# EAGLE design v4.0 (EAGLE 8.6.3)
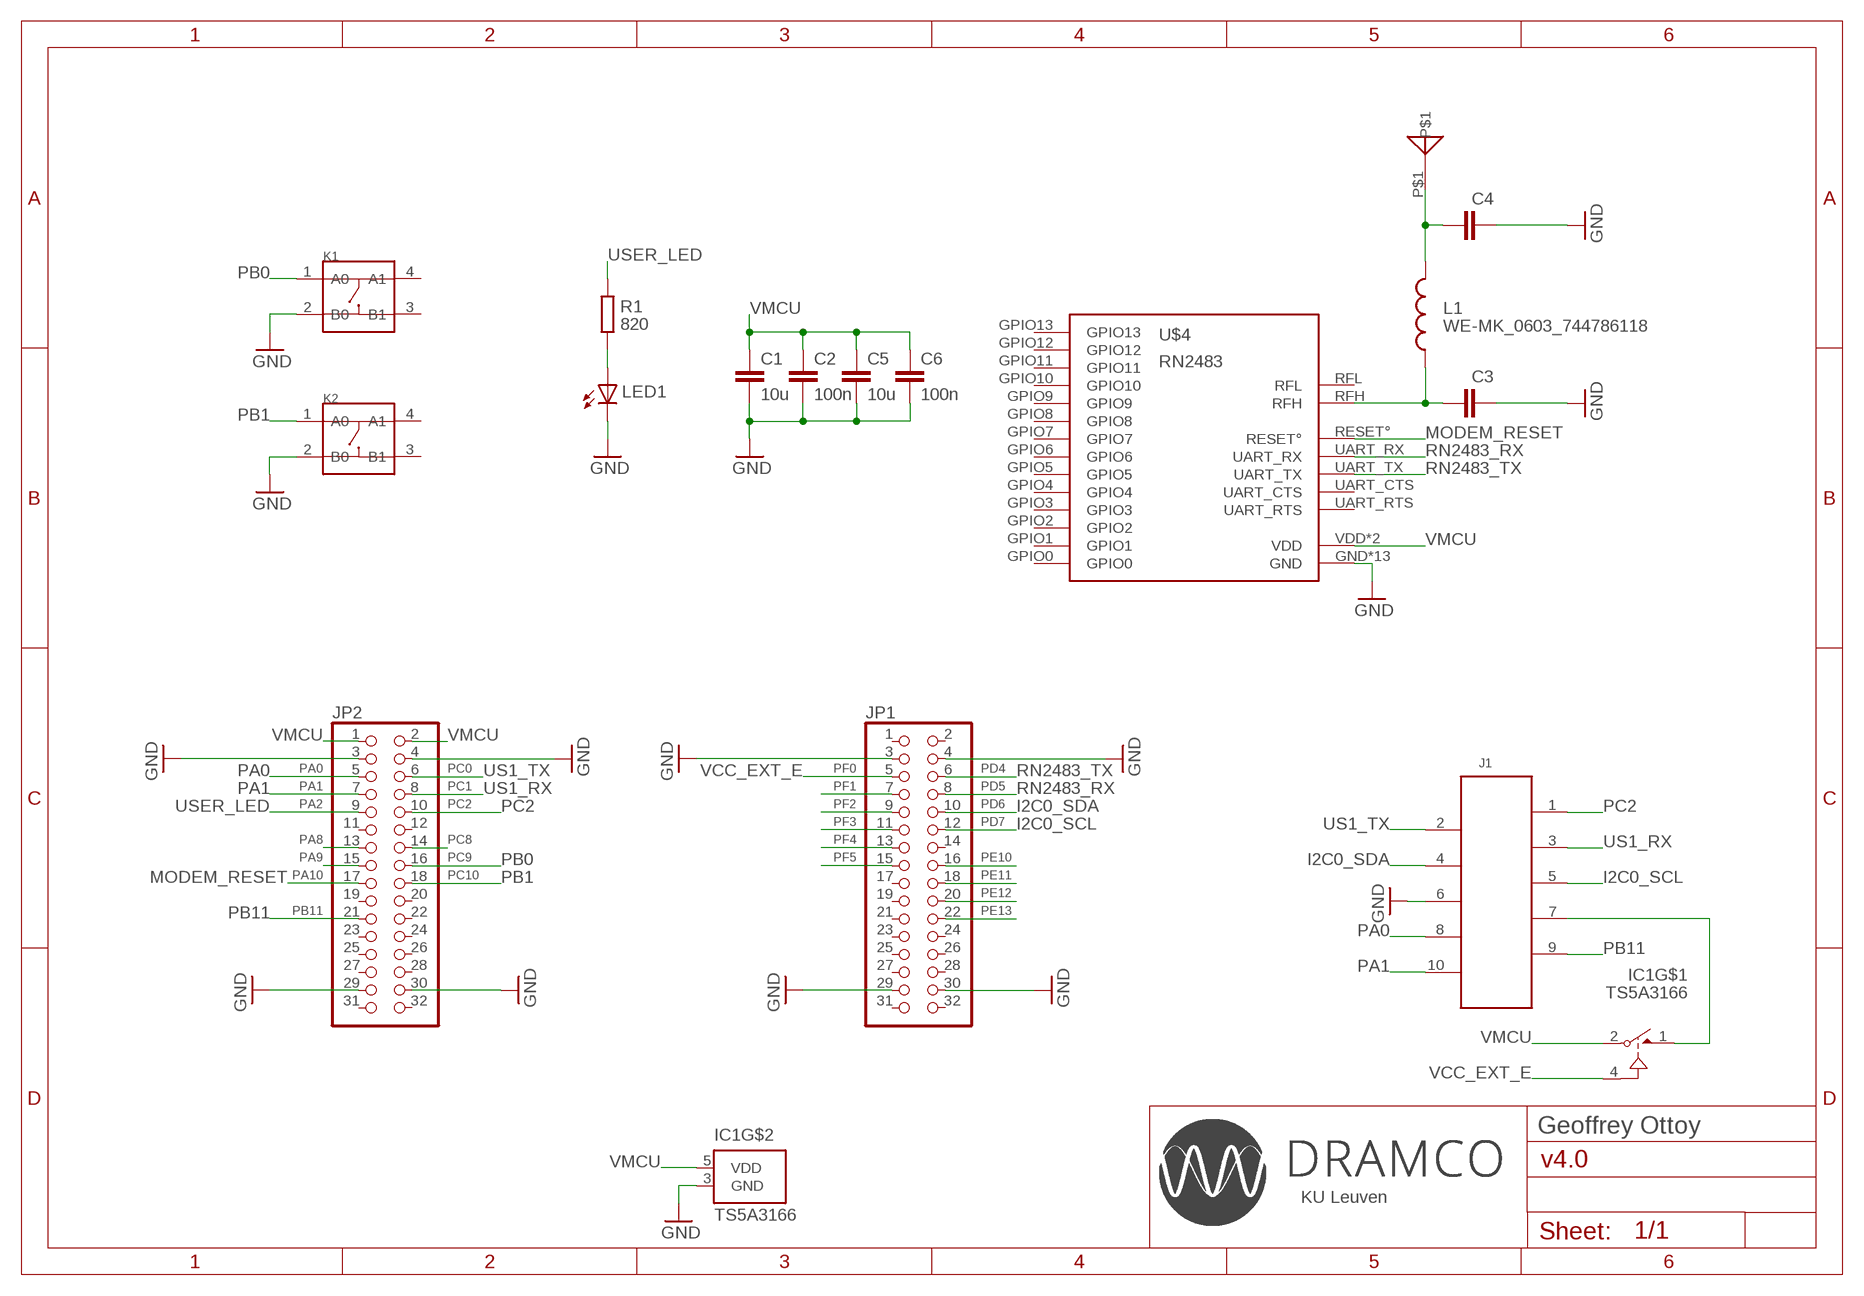
[diagram p0: schematic, sheet 1]

## Parts
C1  10u  C-EUC0805K  [C0805K]
C2  100n  C-EUC0805K  [C0805K]
C3  C-EUC0603K  [C0603K]
C4  C-EUC0603K  [C0603K]
C5  10u  C-EUC0805K  [C0805K]
C6  100n  C-EUC0805K  [C0805K]
IC1  TS5A3166  [SC70-5L]
J1  61001018321  [61001018321]
JP1  PINHD-2X16  [2X16]
JP2  PINHD-2X16  [2X16]
K1  SMD-SWITCH-TACTILE-SPST-NO(4P-D6.0MM)  [SW4-SMD-6.0X6.0X5.0MM]
K2  SMD-SWITCH-TACTILE-SPST-NO(4P-D6.0MM)  [SW4-SMD-6.0X6.0X5.0MM]
L1  WE-MK_0603_744786118  [WE-MK_0603]
LED1  LEDCHIPLED_0805  [CHIPLED_0805]
R1  820  R-EU_R0805  [R0805]
U$2  ANTENNA868  [CERAMIC-ANTENNA]
U$4  RN2483  [RN2483]

## Nets
GND: C1.2 C2.2 C3.1 C4.1 C5.2 C6.2 IC1.3(GND) J1.6 JP1.3 JP1.4 JP1.29 JP1.30 JP2.3 JP2.4 JP2.29 JP2.30 K1.2(B0) K2.2(B0) LED1.C U$4.GND U$4.GND1(GND) U$4.GND2(GND) U$4.GND3(GND) U$4.GND4(GND) U$4.GND5(GND) U$4.GND6(GND) U$4.GND7(GND) U$4.GND8(GND) U$4.GND9(GND) U$4.GND10(GND) U$4.GND11(GND) U$4.GND12(GND)
N$1: LED1.A R1.1
N$2: C3.2 L1.1 U$4.RFH
N$3: C4.2 L1.2 U$2.P$1
N$4: IC1.1(NO) J1.7
PA0: J1.8 JP2.5
PA1: J1.10 JP2.7
PA2: JP2.9 R1.2
PA8: JP2.13
PA9: JP2.15
PA10: JP2.17 U$4.RESET°
PB11: J1.9 JP2.21
PC0: J1.2 JP2.6
PC1: J1.3 JP2.8
PC2: J1.1 JP2.10
PC8: JP2.14
PC9: JP2.16 K1.1(A0)
PC10: JP2.18 K2.1(A0)
PD4: JP1.6 U$4.UART_TX
PD5: JP1.8 U$4.UART_RX
PD6: J1.4 JP1.10
PD7: J1.5 JP1.12
PE10: JP1.16
PE11: JP1.18
PE12: JP1.20
PE13: JP1.22
PF0: IC1.4(IN) JP1.5
PF1: JP1.7
PF2: JP1.9
PF3: JP1.11
PF4: JP1.13
PF5: JP1.15
VMCU: C1.1 C2.1 C5.1 C6.1 IC1.2(COM) IC1.5(VDD) JP2.1 JP2.2 U$4.VDD U$4.VDD2(VDD)
Unconnected: JP1.1 JP1.2 JP1.14 JP1.17 JP1.19 JP1.21 JP1.23 JP1.24 JP1.25 JP1.26 JP1.27 JP1.28 JP1.31 JP1.32 JP2.11 JP2.12 JP2.19 JP2.20 JP2.22 JP2.23 JP2.24 JP2.25 JP2.26 JP2.27 JP2.28 JP2.31 JP2.32 K1.3(B1) K1.4(A1) K2.3(B1) K2.4(A1) U$4.GPIO0 U$4.GPIO1 U$4.GPIO2 U$4.GPIO3 U$4.GPIO4 U$4.GPIO5 U$4.GPIO6 U$4.GPIO7 U$4.GPIO8 U$4.GPIO9 U$4.GPIO10 U$4.GPIO11 U$4.GPIO12 U$4.GPIO13 U$4.RFL U$4.UART_CTS U$4.UART_RTS

## Notes on the sheet
- USER_LED
- PB0
- PB1
- MODEM_RESET
- RN2483_RX
- RN2483_TX
- PA0 | US1_TX | VCC_EXT_E | RN2483_TX
- PA1 | US1_RX | RN2483_RX
- USER_LED | PC2 | I2C0_SDA
- I2C0_SCL | US1_TX
- US1_RX
- PB0 | I2C0_SDA
- MODEM_RESET | PB1 | I2C0_SCL
- PB11
- VCC_EXT_E
- Geoffrey Ottoy
- KU Leuven

## Library data of the parts
C1-C6 = rcl:C-EU: CAPACITOR, European symbol; SPICEPREFIX: C
IC1 = project:TS5A3166
J1 = project:61001018321: WR-PHD 2.54mm SMT Pin Header, 10 Pins =>Code : Con_BTB_PHD_2.54_1_SMT_61001018321 <http://katalog.we-online.de/media/images/eican/Con_BTB_PHD_2.54_1_SMT_6100xx18221_pf2.jpg> Details see: http://katalog.we-online.de/en/em/610_0xx_182_21 Created 2014-05-29, Karrer Zheng 2014 (C) Würth Elektronik
JP1 JP2 = pinhead:PINHD-2X16: PIN HEADER
K1 K2 = Seeed-Switch:SMD-SWITCH-TACTILE-SPST-NO(4P-D6.0MM): 311020004; MPN: DTSM-62K-S-V-T/R(SN431)
L1 = project:WE-MK_0603_744786118
LED1 = led:LED: LED OSRAM: - CHIPLED LG R971, LG N971, LY N971, LG Q971, LY Q971, LO R971, LY R971 LH N974, LH R974 LS Q976, LO Q976, LY Q976 LO Q996 - Hyper CHIPLED LW Q18S LB Q993, LB Q99A, LB R99A - SideLED LS A670, LO A670, LY A670, LG A670, LP A670 LB A673, LV A673, LT A673, LW A673 LH A674 LY A675 LS A676, LA A676, LO A676, LY A676, LW A676 LS A679, LY A679, LG A679 - Hyper Micro SIDELED® LS Y876, LA Y876, LO Y876, LY Y876 LT Y87S - SmartLED LW L88C, LW L88S LB L89C, LB L89S, LG L890 LS L89K, LO L89K, LY L89K LS L896, LA L896, LO L896, LY L896 - TOPLED LS T670, LO T670, LY T670, LG T670, LP T670 LSG T670, LSP T670, LSY T670, LOP T670, LYG T670 LG T671, LOG T671, LSG T671 LB T673, LV T673, LT T673, LW T673 LH T674 LS T676, LA T676, LO T676, LY T676, LB T676, LH T676, LSB T676, LW T676 LB T67C, LV T67C, LT T67C, LS T67K, LO T67K, LY T67K, LW E67C LS E67B, LA E67B, LO E67B, LY E67B, LB E67C, LV E67C, LT E67C LW T67C LS T679, LY T679, LG T679 LS T770, LO T770, LY T770, LG T770, LP T770 LB T773, LV T773, LT T773, LW T773 LH T774 LS E675, LA E675, LY E675, LS T675 LS T776, LA T776, LO T776, LY T776, LB T776 LHGB T686 LT T68C, LB T68C - Hyper Mini TOPLED® LB M676 - Mini TOPLED Santana® LG M470 LS M47K, LO M47K, LY M47K Source: http://www.osram.convergy.de LUXEON: - LUMILED® LXK2-PW12-R00, LXK2-PW12-S00, LXK2-PW14-U00, LXK2-PW14-V00 LXK2-PM12-R00, LXK2-PM12-S00, LXK2-PM14-U00 LXK2-PE12-Q00, LXK2-PE12-R00, LXK2-PE12-S00, LXK2-PE14-T00, LXK2-PE14-U00 LXK2-PB12-K00, LXK2-PB12-L00, LXK2-PB12-M00, LXK2-PB14-N00, LXK2-PB14-P00, LXK2-PB14-Q00 LXK2-PR12-L00, LXK2-PR12-M00, LXK2-PR14-Q00, LXK2-PR14-R00 LXK2-PD12-Q00, LXK2-PD12-R00, LXK2-PD12-S00 LXK2-PH12-R00, LXK2-PH12-S00 LXK2-PL12-P00, LXK2-PL12-Q00, LXK2-PL12-R00 Source: www.luxeon.com KINGBRIGHT: KA-3528ASYC Source: www.kingbright.com
R1 = rcl:R-EU_: RESISTOR, European symbol; SPICEPREFIX: R
U$2 = project:ANTENNA868
U$4 = project:RN2483

## Board
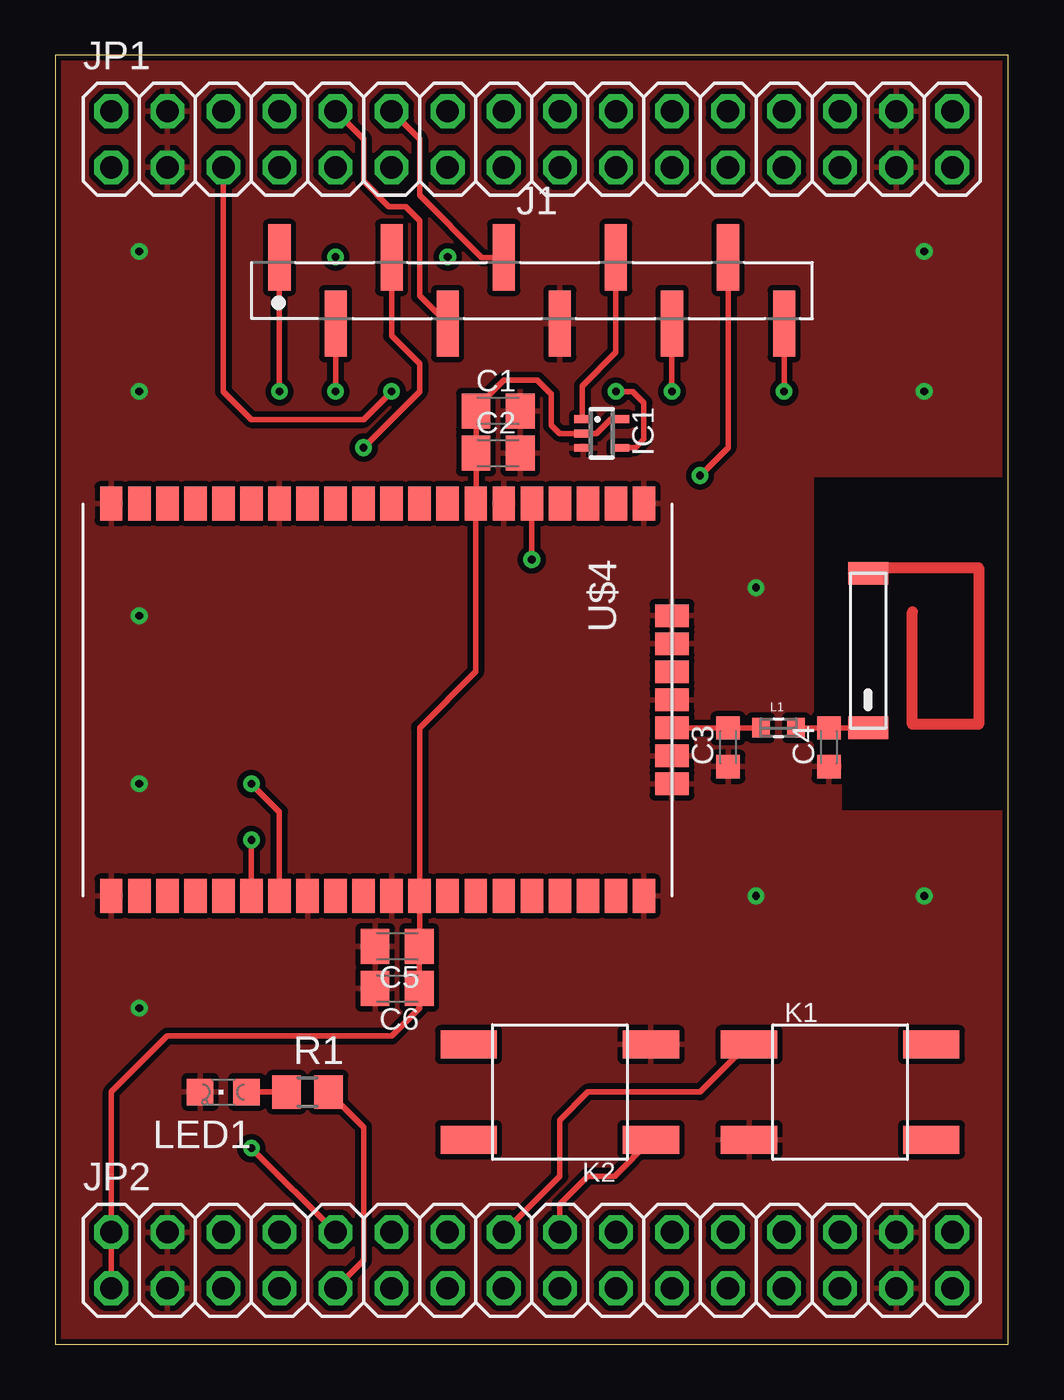
[diagram p1: board, top side]
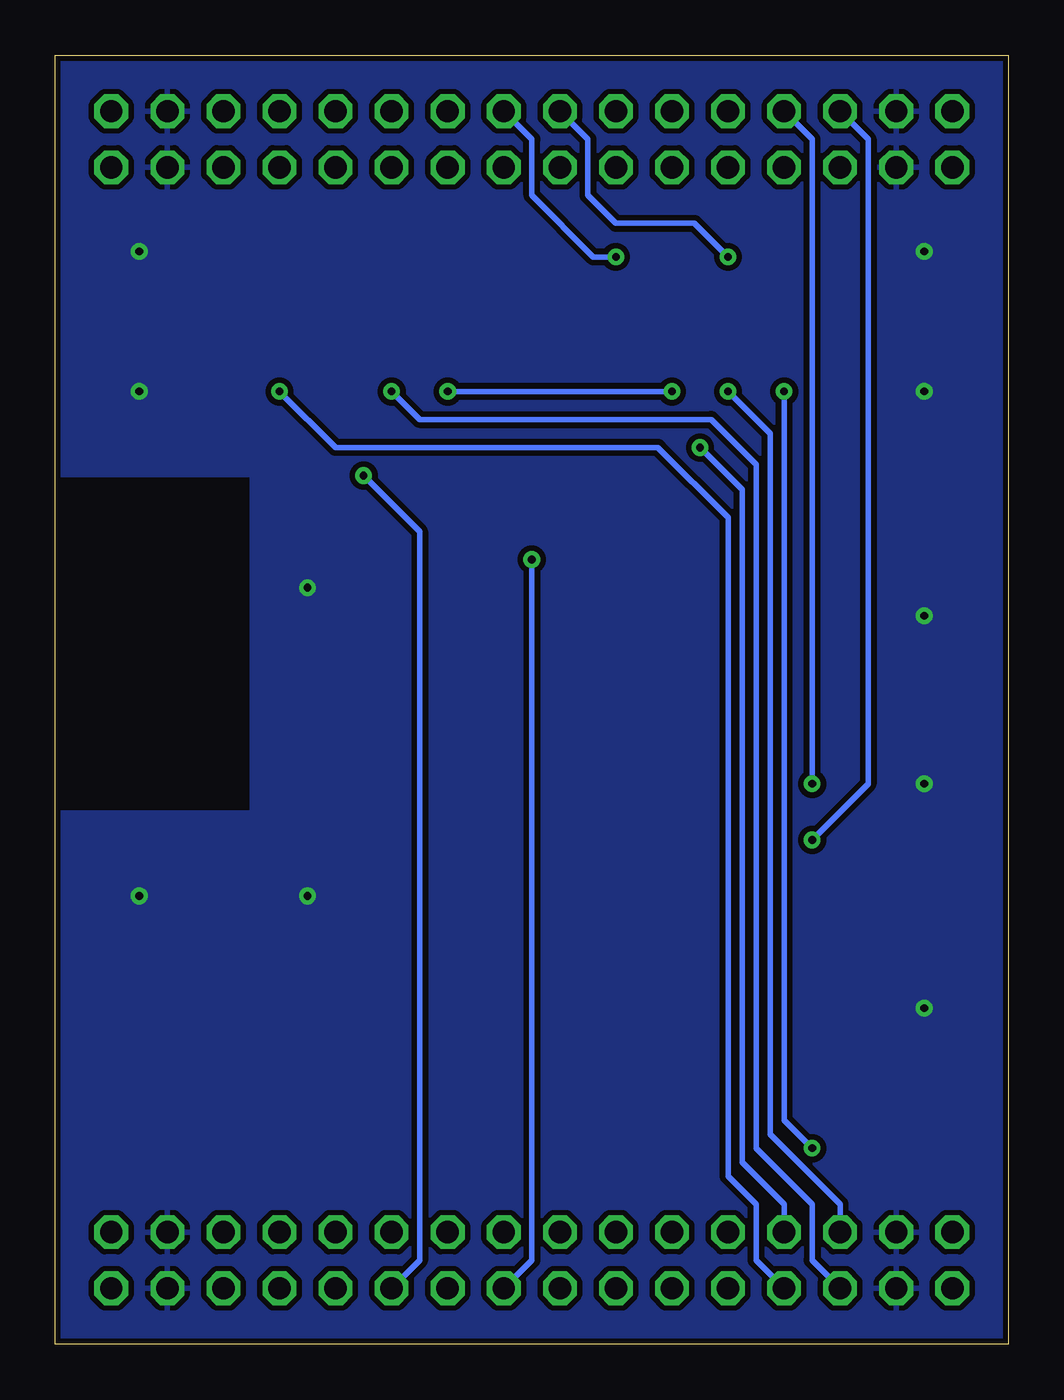
[diagram p2: board, bottom side, seen from below]

Size 43.18 x 58.42 mm. Coordinates in mm from the lower left corner, seen from the top.
Outline: 0,58.42 0,58.41
Outline: 0,58.41 0,0 43.18,0 43.18,58.42 0,58.41
Copper layers (1*16): Top 0.035mm / dielectric 1.5mm / Bottom 0.035mm
Design rules "default *": minimum track width 6mil, minimum drill 0.35mm, track to track 10mil, track to pad 10mil, pad to pad 10mil, via to via 10mil, smd to smd 10mil, copper to edge 10mil, drill to drill 10mil, minimum pad ring 10mil, minimum via ring 8mil, stop-mask expansion 4mil, vias tented up to drill 0mil, thermal gap 10mil

### Footprints (pad centres in the part's own frame; a part is rotated, then mirrored left to right if it is on the bottom)
C0805K = smd 1.3 x 1.6: 1 -1,0; 2 1,0
C0603K = smd 1.05 x 1.08: 1 -0.875,0; 2 0.875,0
SC70-5L = smd 0.35 x 0.8: 1 -0.65,-0.85; 2 0,-0.85; 3 0.65,-0.85; 4 0.65,0.85; 5 -0.65,0.85
61001018321 = smd 1 x 3: 1 -11.43,1.5; 2 -8.89,-1.5; 3 -6.35,1.5; 4 -3.81,-1.5; 5 -1.27,1.5; 6 1.27,-1.5; 7 3.81,1.5; 8 6.35,-1.5; 9 8.89,1.5; 10 11.43,-1.5
2X16 = drill 1.016 octagon: 1 -19.05,-1.27; 2 -19.05,1.27; 3 -16.51,-1.27; 4 -16.51,1.27; 5 -13.97,-1.27; 6 -13.97,1.27; 7 -11.43,-1.27; 8 -11.43,1.27; 9 -8.89,-1.27; 10 -8.89,1.27; 11 -6.35,-1.27; 12 -6.35,1.27; 13 -3.81,-1.27; 14 -3.81,1.27; 15 -1.27,-1.27; 16 -1.27,1.27; 17 1.27,-1.27; 18 1.27,1.27; 19 3.81,-1.27; 20 3.81,1.27; 21 6.35,-1.27; 22 6.35,1.27; 23 8.89,-1.27; 24 8.89,1.27; 25 11.43,-1.27; 26 11.43,1.27; 27 13.97,-1.27; 28 13.97,1.27; 29 16.51,-1.27; 30 16.51,1.27; 31 19.05,-1.27; 32 19.05,1.27
SW4-SMD-6.0X6.0X5.0MM = smd 2.54 x 1.27: 1 -4.129,2.159; 2 -4.129,-2.159; 3 4.129,-2.159; 4 4.129,2.159
WE-MK_0603 = smd 0.8 x 0.9: 1 -0.8,0; 2 0.8,0
CHIPLED_0805 = smd 1.2 x 1.2: A 0,-1.05; C 0,1.05
R0805 = smd 1.3 x 1.5: 1 -0.95,0; 2 0.95,0
CERAMIC-ANTENNA = smd 1 x 1.8: P$1 0,0; P$2 7,0
RN2483 = smd 1.524 x 1.016: GND 17.78,1.27; GND1 17.78,10.16; GND2 17.78,13.97; GND3 17.78,25.4; GND9 0,25.4; GND10 0,19.05; GND11 0,8.89; GND12 0,1.27; GPIO0 0,16.51; GPIO1 0,15.24; GPIO2 0,13.97; GPIO3 0,12.7; GPIO4 0,11.43; GPIO5 0,10.16; GPIO6 0,6.35; GPIO7 0,5.08; GPIO8 0,3.81; GPIO9 0,2.54; GPIO10 17.78,17.78; GPIO11 17.78,16.51; GPIO12 17.78,12.7; GPIO13 17.78,11.43; P$1 0,21.59; P$2 0,22.86; P$3 0,24.13; P$4 17.78,24.13; P$5 17.78,22.86; P$6 17.78,21.59; P$7 17.78,20.32; P$8 17.78,19.05; P$9 17.78,6.35; P$10 17.78,5.08; P$11 0,7.62; RESET° 0,20.32; UART_CTS 17.78,3.81; UART_RTS 17.78,2.54; UART_RX 17.78,8.89; UART_TX 17.78,7.62; VDD 17.78,15.24; VDD2 0,17.78 | smd 1.016 x 1.524: GND4 12.7,26.67; GND5 11.43,26.67; GND6 8.89,26.67; GND7 6.35,26.67; GND8 5.08,26.67; RFH 10.16,26.67; RFL 7.62,26.67

### Placement (x,y rotation side)
C1  20.07,42.29 0 top
C2  20.07,40.39 0 top
C3  30.48,27.05 90 top
C4  35.05,27.05 90 top
C5  15.49,18.03 180 top
C6  15.49,16.13 180 top
IC1  24.77,41.27 270 top
J1  21.59,47.75 0 top
JP1  21.59,54.61 0 top
JP2  21.59,3.81 0 top
K1  35.56,11.43 0 top
K2  22.86,11.43 180 top
L1  32.77,27.94 0 top
LED1  7.62,11.43 90 top
R1  11.43,11.43 0 top
U$2  36.83,27.94 90 top
U$4  1.27,38.1 270 top

### Tracks (layer width: path | path; a pad name or v marks a point on that pad's centre or on a via)
GND  (via drill 0.35)
  other vias: 3.81,49.53 3.81,43.18 3.81,33.02 3.81,25.4 3.81,15.24 31.75,34.29 31.75,20.32 39.37,20.32 39.37,43.18 39.37,49.53
  pour Bottom: -2.54,58.42 45.72,58.42 45.72,39.37 34.29,39.37 34.29,24.13 45.72,24.13 45.72,0 -2.54,0
  pour Top: -1.27,-1.27 44.45,-1.27 44.45,24.13 35.56,24.13 35.56,26.67 34.29,26.67 34.29,39.37 44.45,39.37 44.45,59.69 -1.27,59.69
N$1
  Top 0.254: LED1.A R1.1
N$2
  Top 0.152: U$4.RFH 27.95,27.93 | 31.95,27.93 L1.1
  Top 0.254: 27.95,27.93 C3.2 31.95,27.93
N$3
  Top 0.152: 35.04,27.94 C4.2 | 36.82,27.93 U$2.P$1
  Top 0.254: L1.2 35.04,27.94 | C4.2 36.82,27.93
N$4
  Top 0.254: IC1.1 23.88,41.96 23.88,43.43 25.4,44.96 J1.7
PA0  (via drill 0.35)
  Top 0.254: J1.8 v27.94,43.18
  Bottom 0.254: v27.94,43.18 26.67,41.91 13.46,41.91 11.43,39.88 11.43,8.89 8.89,6.35 8.89,3.81 JP2.5
PA1  (via drill 0.35)
  Top 0.254: v33.02,43.18 J1.10
  Bottom 0.254: JP2.7 11.43,3.81 11.43,6.35 12.7,7.62 12.7,37.47 15.88,40.64 30.48,40.64 v33.02,43.18
PA2
  Top 0.254: JP2.9 13.97,3.81 13.97,9.84 R1.2
PA10  (via drill 0.35)
  Top 0.254: U$4.RESET° v21.59,35.56
  Bottom 0.254: v21.59,35.56 21.59,3.81 JP2.17
PB11  (via drill 0.35)
  Top 0.254: J1.9 30.48,40.64 v29.21,39.37
  Bottom 0.254: v29.21,39.37 26.67,36.83 26.67,3.81 JP2.21
PC0  (via drill 0.35)
  Top 0.254: v12.7,43.18 J1.2
  Bottom 0.254: JP2.6 7.62,6.35 10.79,9.53 10.79,41.27 v12.7,43.18
PC1  (via drill 0.35)
  Top 0.254: J1.3 15.24,45.72 16.51,44.45 16.51,43.18 v13.97,40.64
  Bottom 0.254: JP2.8 10.16,6.35 12.06,8.26 12.06,36.83 12.06,38.73 v13.97,40.64
PC2  (via drill 0.35)
  Top 0.254: JP2.10 v8.89,8.89 | v10.16,43.18 J1.1
  Bottom 0.254: v8.89,8.89 10.16,10.16 10.16,20.32 v10.16,43.18
PC9
  Top 0.152: K1.1 31.37,13.59
  Top 0.254: JP2.16 22.86,7.62 22.86,10.16 24.13,11.43 29.21,11.43 31.37,13.59
PC10
  Top 0.254: K2.1 25.34,7.62 24.13,7.62 22.86,6.35 JP2.18
PD4  (via drill 0.35)
  Top 0.254: v8.89,22.86 U$4.UART_TX
  Bottom 0.254: JP1.6 6.35,54.61 6.35,25.4 v8.89,22.86
PD5  (via drill 0.35)
  Top 0.254: U$4.UART_RX 10.16,24.13 v8.89,25.4
  Bottom 0.254: v8.89,25.4 8.89,54.61 JP1.8
PD6
  Top 0.254: JP1.10 13.97,54.61 13.97,52.7 15.11,51.56 15.88,51.56 16.51,50.93 16.51,47.52 J1.4
PD7
  Top 0.254: JP1.12 16.51,54.61 16.51,52.07 19.33,49.25 J1.5
PE10  (via drill 0.35)
  Bottom 0.254: JP1.16 19.05,54.61 19.05,52.07 17.78,50.8 14.22,50.8 v12.7,49.28
PE11  (via drill 0.35)
  Top 0.152: 17.5,49.25 v17.78,49.28
  Bottom 0.254: v17.78,49.28 18.8,49.28 21.59,52.07 21.59,54.61 JP1.18
PF0  (via drill 0.35)
  Top 0.254: JP1.5 7.62,43.18 8.89,41.91 13.97,41.91 v15.24,43.18 | IC1.4 25.63,40.64 26.29,40.64 26.67,41.02 26.67,42.67 26.16,43.18 v25.4,43.18
  Bottom 0.254: v15.24,43.18 v25.4,43.18
VMCU
  Top 0.152: 16.51,18.05 C5.1 | 19.07,38.12 U$4.VDD2 | C1.1 19.07,41.91 19.05,41.93 | 16.51,15.24 16.49,15.26
  Top 0.254: 16.51,18.05 U$4.VDD 16.51,27.94 19.05,30.48 U$4.VDD2 | C5.1 C6.1 16.49,15.26 | 19.07,38.12 C2.1 19.07,41.91 | 19.05,42.42 19.05,41.93 | JP2.1 JP2.2 2.54,11.43 5.08,13.97 15.24,13.97 16.51,15.24 | C1.1 19.07,42.43 20.32,43.69 21.84,43.69 22.48,43.05 22.48,41.66 22.86,41.27 IC1.2 24.51,41.27 25.16,41.92 IC1.5

### Text on the board
Silkscreen: TX | SDA | GND | PA0 | PA1 | PC2 | RX | SCL | VCC | PB11 | ° | C:/Users/geoffrey/Pictures/logo-text-black.bmp | C1 | C2 | IC1 | L1 | C3 | C4 | RN2483 | C5 | C6 | PB1 | PB0 | LED | R1 | LORA Gecko v4.0